# Altium schematic sheet Power.SchDoc
size A; SheetNumber: 2; SheetTotal: 3
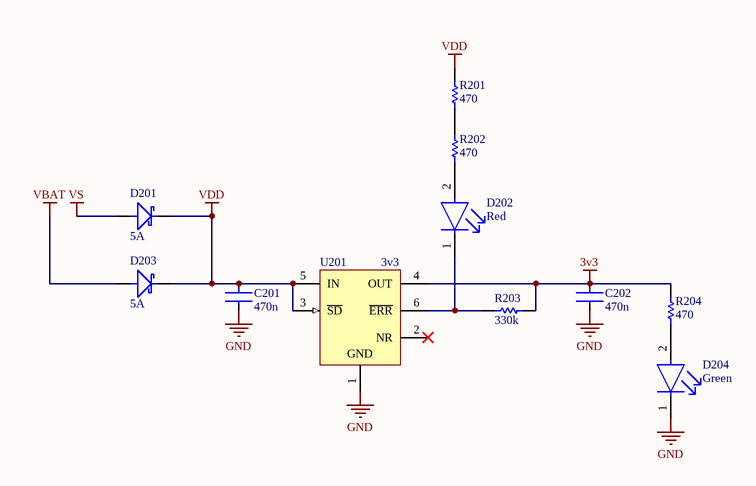
[diagram p0: Power.SchDoc]

## Parts
C201  470n  [FP-GRT155-0_05-MFG]
C202  470n  [FP-GRT155-0_05-MFG]
D201  5A  [SODFL470X105-2L]
D202  Red  [FP-SML-P1-MFG]
D203  5A  [SODFL470X105-2L]
D204  Green  [FP-SML-P1-MFG]
R201  470  [RESC1005X04N]
R202  470  [RESC1005X04N]
R203  330k  [RESC1005X04N]
R204  470  [RESC1005X04N]
U201  3v3  [SOT95P280X145-6L]

## Nets
3v3: C202.1 R203.1 R204.2 U201.4(OUT)
GND: C201.2 C202.2 D204.1(C) U201.1(GND)
VBAT: D203.2
VDD: C201.1 D201.1 D203.1 R201.2 U201.3(~{SD}) U201.5(IN)
VS: D201.2
NetD202_1: D202.1(C) R203.2 U201.6(~{ERR})
NetD202_2: D202.2(A) R202.1
NetD204_2: D204.2(A) R204.1
NetR201_1: R201.1 R202.2

Not connected (* = marked no-connect by the designer): U201 2(NR)*

## Library data of the parts
C201 C202 = GRT155R61E474KE01D: Multi-Layer Ceramic Capacitor 470nF 25V X5R ±10% 0402 Paper T/R; Tolerance: 10%; Packaging: Tape and Reel; Capacitance: 470nF; Case Code (Imperial): 0402; Ratings: AEC-Q200; Max Operating Temperature: 85°C; Case/Package: 0402; Length: 0.039inch; Width: 0.02inch; Case Code (Metric): 1005; Mount: Surface Mount; Voltage Rating: 25V; Thickness: 0.022inch; Min Operating Temperature: -55°C; Supplier 1: Digi-Key; Supplier Part Number 1: 490-12269-1-ND
D201 D203 = RB080LAM-30TR: Supplier 1: Digi-Key; Supplier Part Number 1: RB080LAM-30CT-ND
D202 = SML-P11UTT86R: LED RED CLEAR 1006 SMD; Manufacturer: Rohm; Wavelength: 621nm; Led Orientation: Top View; Luminous Intensity: 2.5mcd; Power Dissipation: 50mW; Forward Voltage: 1.8V; Reverse Voltage: 5V; Forward Current: 1mA; Manufacturer Part Number: SML-P11UTT86R; Device Class L2: LEDs; RoHS: TRUE; Device Class L1: Optoelectronics; Colour: Red; Lead Free: Yes; Height: 0.25mm; Automotive: No; Octopart: https://octopart.com/sml-p11utt86r-rohm-39058751; Temperature: -40°C to +85°C; Temperature Range Low: -40°C; Package: SML-P1; ComponentLink2URL: https://www.rohm.com/datasheet/SML-P11UT(R)/sml-p11-e; ComponentLink2Description: Datasheet; Category: Diode; Temperature Range High: +85°C; Device Class L3: unset; Mouser Description: Led, Picoled, Red, 621 Nm, 1.8 V, 1 Ma, 2.5 Mcd; Digikey Description: LED RED CLEAR 1006 SMD; Supplier 1: Digi-Key; Supplier Part Number 1: SML-P11UTT86RCT-ND
D204 = SML-P13PTT86R: LED GREEN CLEAR 1006 SMD; Manufacturer: Rohm; Power Dissipation: 52mW; Forward Current: 20mA; Reverse Voltage: 5V; Led Orientation: Top View; Forward Voltage: 2.1V; Luminous Intensity: 10mcd; Wavelength: 560nm; Temperature: -40°C to +85°C; Digikey Description: LED GREEN CLEAR 1006 SMD; Manufacturer Part Number: SML-P13PTT86R; Lead Free: Yes; Height: 0.25mm; Package: SML-P1; RoHS: TRUE; Mouser Description: LED Uni-Color Green 2-Pin Chip 0402(1006Metric) T/R; Device Class L2: LEDs; ComponentLink2URL: https://d1d2qsbl8m0m72.cloudfront.net/en/products/databook/datasheet/opto/led/chip_mono/sml-p1-e.pdf; Device Class L1: Optoelectronics; ComponentLink2Description: Datasheet; Category: Diode; Temperature Range High: +85°C; Automotive: No; Temperature Range Low: -40°C; Octopart: https://octopart.com/sml-p13ptt86r-rohm-59370256; Device Class L3: unset; Colour: Green; Supplier 1: Digi-Key; Supplier Part Number 1: 846-1197-1-ND
R201 R202 R204 = ERJ-U02J471X: Manufacturer: Panasonic; Part Number: ERJ2RKF27R0X; Supplier 1: Digi-Key; Supplier Part Number 1: 10-ERJ-U02J471XCT-ND
R203 = ERJ-2GEJ334X: Manufacturer: Panasonic; Part Number: ERJ2RKF27R0X; Supplier 1: Digi-Key; Supplier Part Number 1: P330KJCT-ND
U201 = ADP3300ARTZ-3.3RL7: High Accuracy anyCAP(R) 50 mA Low Dropout Linear Regulator, 3 to 12 V Vin, 3.3 V Vout, Industrial, 6-pin SOT23 (RT-6), Reel; Manufacturer: Analog Devices; Supply Current IGND @ Small Load: 190uA; Vin (max) (V): 12; Iout max: 50mA; Vin (min) (V): 3; Preset Vout Values (V): 3.3; PackageReference: RT-6; Packing: Reel; ComponentLink2Description: Datasheet; ComponentLink4URL: Product URL:http://www.analog.com/en/ADP3300/productSearch.html; ComponentLink3Description: Package Specification; ComponentLink4Description: URL Link1; ComponentLink2URL: http://www.analog.com/static/imported-files/data_sheets/ADP3300.pdf; ComponentLink1URL: http://www.analog.com/en/index.html; PartNumber: ADP3300ARTZ-3.3RL7; Mounting Technology: Surface Mount; PackageDescription: 6-Pin Plastic Surface Mount SOT-23 Package, Body 2.9 x 1.65 mm, Pitch 0.95 mm; ComponentLink3URL: http://www.analog.com/static/imported-files/data_sheets/ADG465.pdf; PackageVersion: REV. A, 11/2006; ComponentLink1Description: Manufacturer URL; DatasheetVersion: Rev. B; Supplier 1: Digi-Key; Supplier Part Number 1: ADP3300ARTZ3.3RCT-ND